# EasyEDA Pro project 工程教育PCB设计图.epro

# Schematic Schematic1
Board Name: Board1; Create Date: 2025-10-13; Page Name: P1; Project Name: EP2C8_EVM; Schematic Name: Schematic1; Update Date: 2025-11-10; Company: 嘉立创EDA; Page Size: A4; Version: V1.0
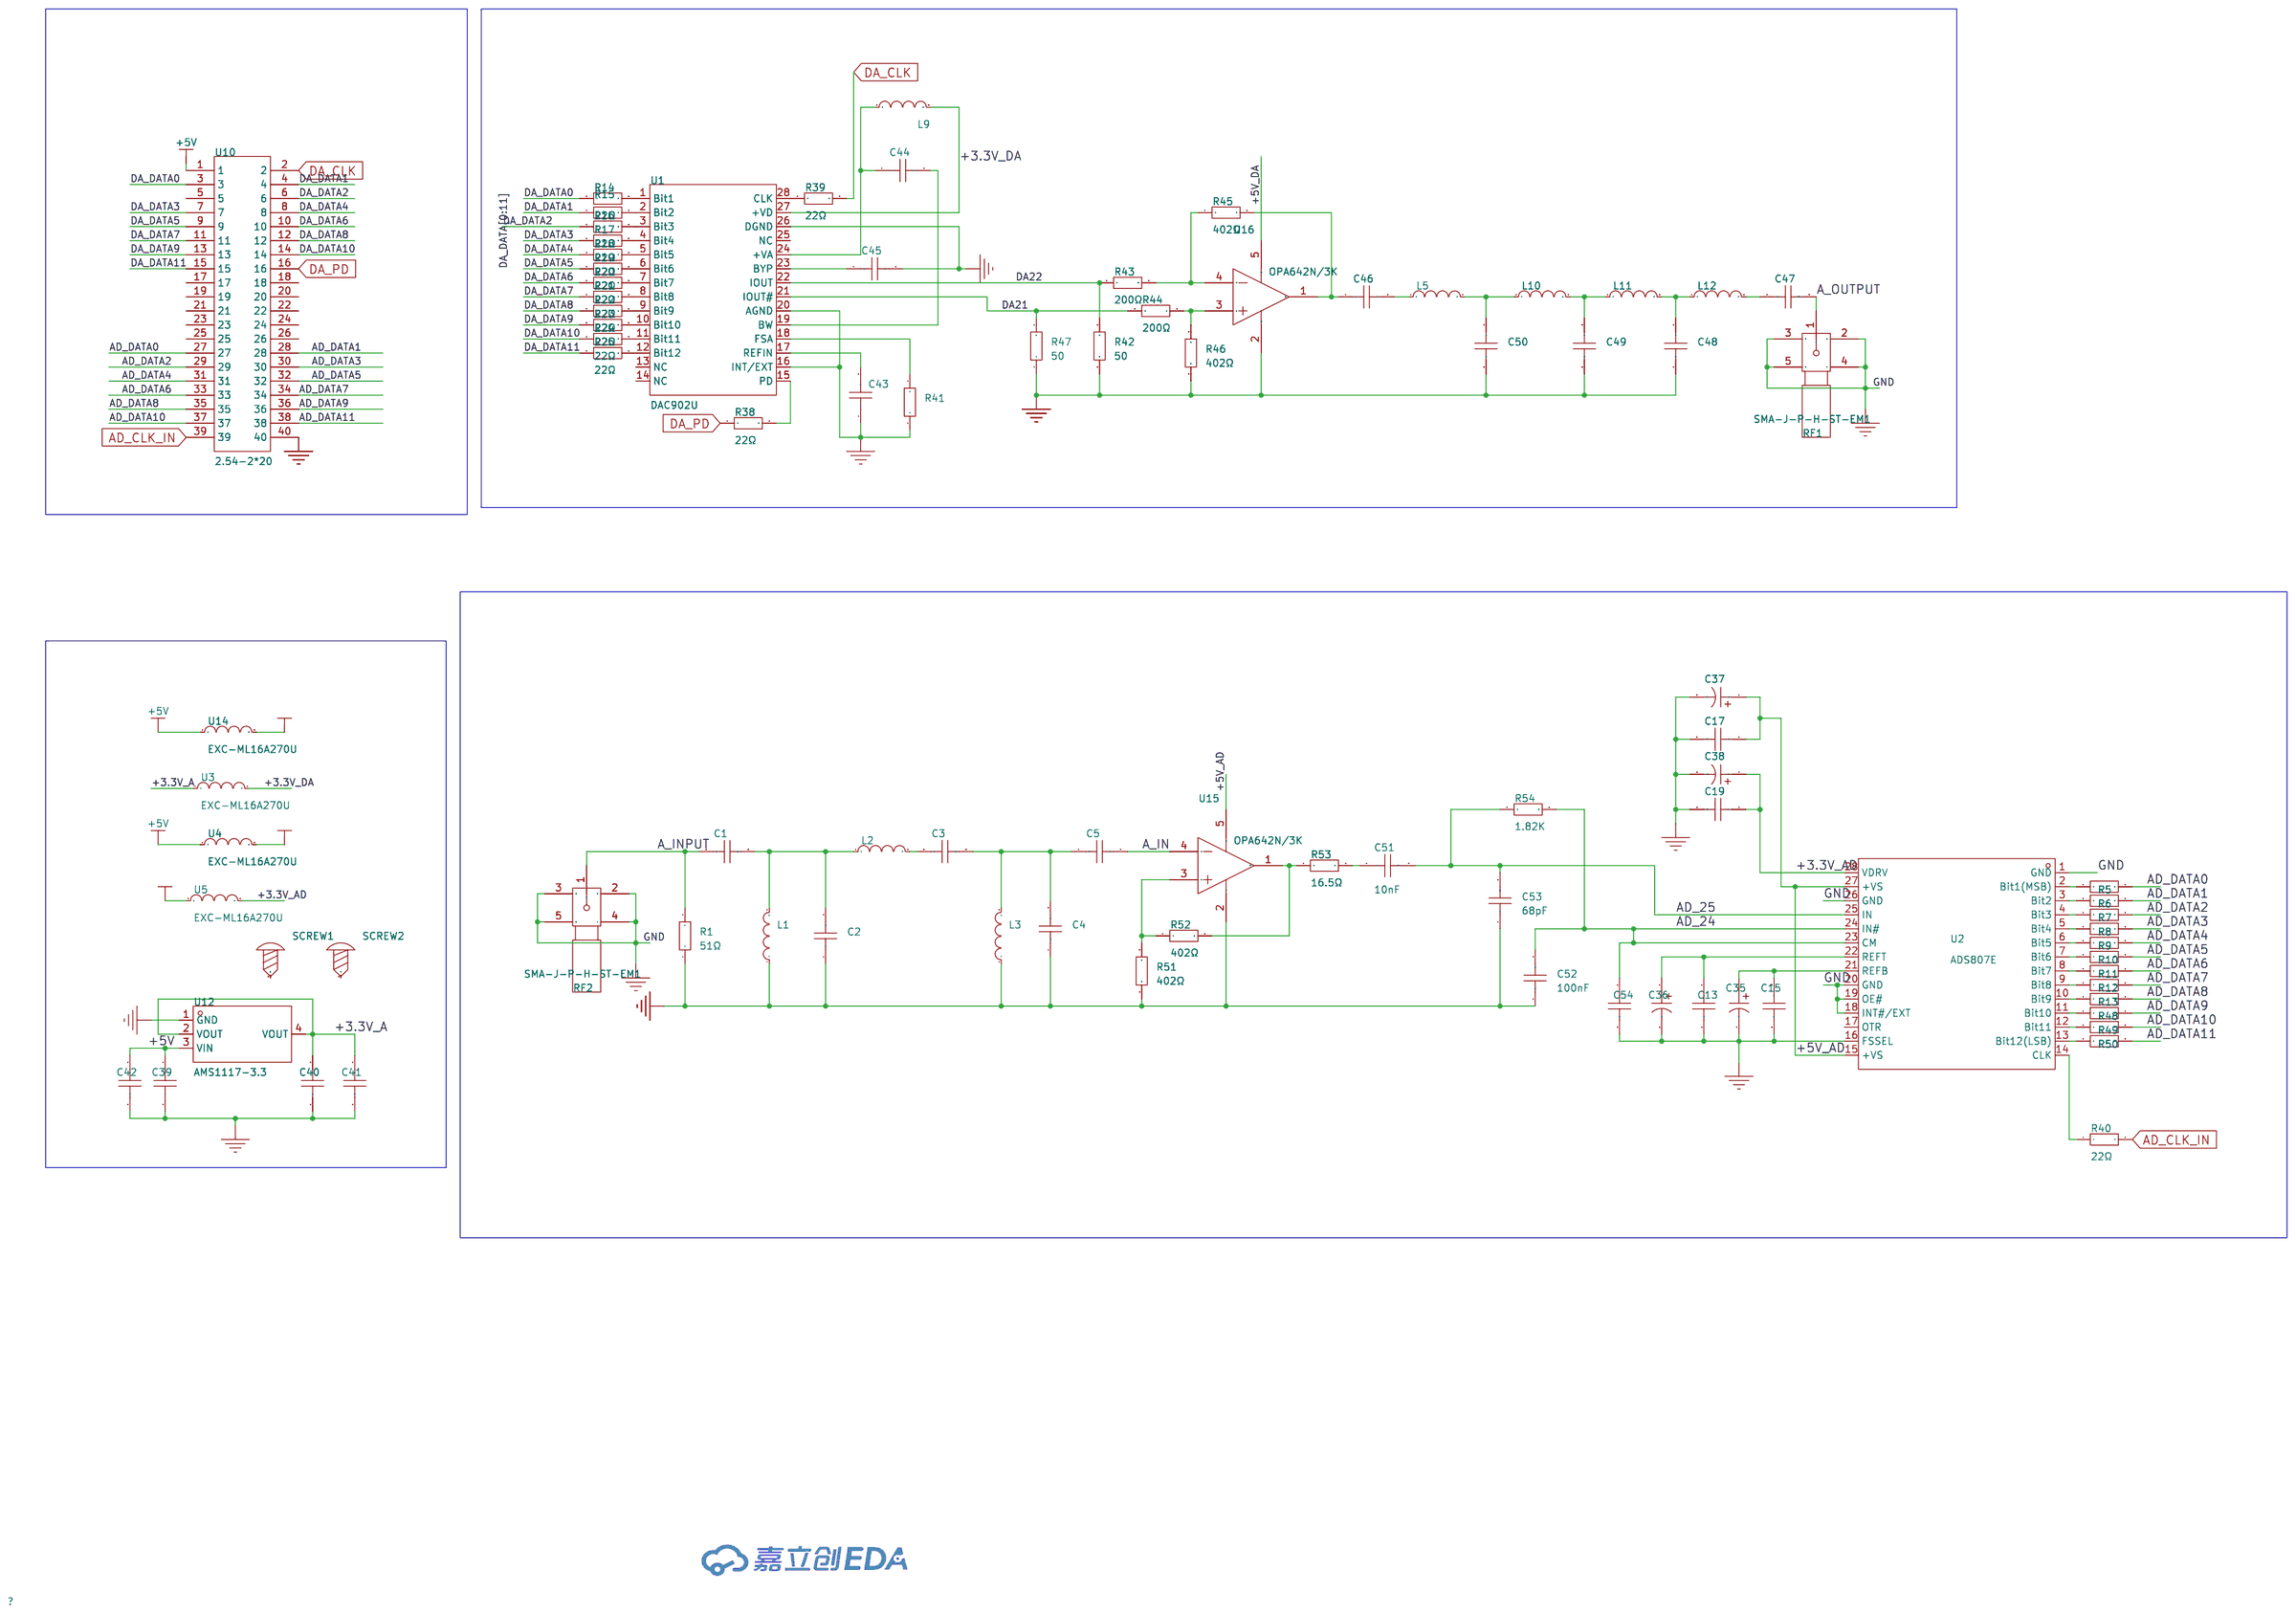
[diagram p0: schematic sheet]

## Parts
C1  100nF  [C0805]
C2  100nF  [C0805]
C3  100nF  [C0805]
C4  100nF  [C0805]
C5  100nF  [C0805]
C13  100nF  [C0805]
C15  100nF  [C0805]
C17  100nF  [C0805]
C19  100nF  [C0805]
C35  10uF  [C0805]
C36  10uF  [C0805]
C37  10uF  [C0805]
C38  10uF  [C0805]
C39  100nF  [C0805]
C40  100nF  [C0805]
C41  22uF  [C0805]
C42  22uF  [C0805]
C43  100nF  [C0805]
C44  100nF  [C0805]
C45  100nF  [C0805]
C46  100nF  [C0805]
C47  100nF  [C0805]
C48  500pF  [C0805]
C49  850pF  [C0805]
C50  500pF  [C0805]
C51  10nF  [C0805]
C52  100nF  [C0805]
C53  68pF  [C0805]
C54  100nF  [C0805]
L1  1uH  [L0805]
L2  1uH  [L0805]
L3  1uH  [L0805]
L5  500nH  [L0805]
L9  1uH  [L0805]
L10  2uH  [L0805]
L11  2uH  [L0805]
L12  500nH  [L0805]
R1  51Ω  [R0805]
R5  22Ω  [R0805]
R6  22Ω  [R0805]
R7  22Ω  [R0805]
R8  22Ω  [R0805]
R9  22Ω  [R0805]
R10  22Ω  [R0805]
R11  22Ω  [R0805]
R12  22Ω  [R0805]
R13  22Ω  [R0805]
R14  22Ω  [R0805]
R15  22Ω  [R0805]
R16  22Ω  [R0805]
R17  22Ω  [R0805]
R18  22Ω  [R0805]
R19  22Ω  [R0805]
R20  22Ω  [R0805]
R21  22Ω  [R0805]
R22  22Ω  [R0805]
R23  22Ω  [R0805]
R24  22Ω  [R0805]
R25  22Ω  [R0805]
R38  22Ω  [R0805]
R39  22Ω  [R0805]
R40  22Ω  [R0805]
R41  2kΩ  [R0805]
R42  50  [R0805]
R43  200Ω  [R0805]
R44  200Ω  [R0805]
R45  402Ω  [R0805]
R46  402Ω  [R0805]
R47  50  [R0805]
R48  22Ω  [R0805]
R49  22Ω  [R0805]
R50  22Ω  [R0805]
R51  402Ω  [R0805]
R52  402Ω  [R0805]
R53  16.5Ω  [R0805]
R54  1.82K  [R0603]
RF1  SMA-J-P-H-ST-EM1  [SMA-SMD_SMA-J-P-H-ST-EM1]
RF2  SMA-J-P-H-ST-EM1  [SMA-SMD_SMA-J-P-H-ST-EM1]
SCREW1  -  [M3螺丝]
SCREW2  -  [M3螺丝]
U1  DAC902U  [SOIC-28_L18.0-W7.5-P1.27-LS10.3-BL]
U2  ADS807E  [SSOP-28_L10.2-W5.3-P0.65-LS7.8-BL]
U3  EXC-ML16A270U  [L0805]
U4  EXC-ML16A270U  [L0805]
U5  EXC-ML16A270U  [L0805]
U10  2.54-2*20  [HDR-TH_40P-P2.54-V-F-R2-C20-S2.54]
U12  AMS1117-3.3  [SOT-223-3_L6.5-W3.4-P2.30-LS7.0-BR]
U14  EXC-ML16A270U  [L0805]
U15  OPA642N/3K  [SOT-23-5_L2.9-W1.6-P0.95-LS2.8-BR]
U16  OPA642N/3K  [SOT-23-5_L2.9-W1.6-P0.95-LS2.8-BR]

## Library data of the parts
C1-C5 C13 C15 C17 C19 C43-C47 C51 C52 C54 = CC0805KRX7R9BB104: 容值:100nF;精度:±10%;额定电压:50V;温度系数:X7R;; LCSC Part Name: 100nF ±10% 50V; Supplier Part: C49678; Manufacturer: YAGEO(国巨); Supplier Footprint: 0805; JLCPCB Part Class: Basic Part; Datasheet: https://item.szlcsc.com/datasheet/CC0805KRX7R9BB104/50686.html; Supplier: LCSC; Tolerance: ±10%; Voltage Rating: 50V; Temperature Coefficient: X7R
C35-C38 = CL21A106KAYNNNE_C15850: 容值:10uF;精度:±10%;额定电压:25V;温度系数:X5R;; LCSC Part Name: 10uF ±10% 25V; Supplier Part: C15850; Manufacturer: SAMSUNG(三星); Manufacturer Part: CL21A106KAYNNNE; Supplier Footprint: 0805; JLCPCB Part Class: Basic Part; Datasheet: https://item.szlcsc.com/datasheet/CL21A106KAYNNNE/16532.html; Supplier: LCSC; Tolerance: ±10%; Voltage Rating: 25V; Temperature Coefficient: X5R
C39 C40 = 0805B104K500NT: 容值:100nF;精度:±10%;额定电压:50V;温度系数:X7R;; LCSC Part Name: 100nF ±10% 50V; Supplier Part: C38141; Manufacturer: FH(风华); Supplier Footprint: 0805; JLCPCB Part Class: Extended Part; Datasheet: https://item.szlcsc.com/datasheet/0805B104K500NT/39123.html; Supplier: LCSC; Tolerance: ±10%; Voltage Rating: 50V; Temperature Coefficient: X7R
C41 C42 = CL21A226MAQNNNE: 容值:22uF;精度:±20%;额定电压:25V;温度系数:X5R;; LCSC Part Name: 22uF ±20% 25V; Supplier Part: C45783; Manufacturer: SAMSUNG(三星); Supplier Footprint: 0805; JLCPCB Part Class: Basic Part; Datasheet: https://item.szlcsc.com/datasheet/CL21A226MAQNNNE/46786.html; Supplier: LCSC; Tolerance: ±20%; Voltage Rating: 25V; Temperature Coefficient: X5R
C48 C50 = 0805CG501J500NT: 容值:500pF;精度:±5%;额定电压:50V;温度系数:C0G;; LCSC Part Name: 500pF ±5% 50V; Supplier Part: C502148; Manufacturer: FH(风华); Supplier Footprint: 0805; JLCPCB Part Class: Extended Part; Datasheet: https://item.szlcsc.com/datasheet/0805CG501J500NT/514622.html; Supplier: LCSC; Tolerance: ±5%; Voltage Rating: 50V; Temperature Coefficient: C0G
C49 = C06BL851X-5ZN-X0T: 容值:850pF;额定电压:50V;材质(温度系数):-;; LCSC Part Name: 850pF 50V; Supplier Part: C2182486; Manufacturer: Knowles(楼氏); Supplier Footprint: 0603; JLCPCB Part Class: Extended Part; Datasheet: https://atta.szlcsc.com/upload/public/pdf/source/20210701/A8D84A7CCA583A64334CADCD8883E930.pdf; Supplier: LCSC; Voltage Rated: 50V
C53 = 0805CG680J500NT: 容值:68pF;精度:±5%;额定电压:50V;温度系数:C0G;; LCSC Part Name: 68pF ±5% 50V; Supplier Part: C1834; Manufacturer: FH(风华); Supplier Footprint: 0805; JLCPCB Part Class: Extended Part; Datasheet: https://item.szlcsc.com/datasheet/0805CG680J500NT/2186.html; Supplier: LCSC; Tolerance: ±5%; Voltage Rating: 50V; Temperature Coefficient: C0G
L1-L3 L9 = SDFL2012Q1R0KTF: 电感值:1uH;精度:±10%;额定电流:50mA;饱和电流(Isat):-;直流电阻(DCR):400mΩ;; LCSC Part Name: 1uH ±10%; Supplier Part: C1042; Manufacturer: Sunlord(顺络); Supplier Footprint: 0805; JLCPCB Part Class: Extended Part; Datasheet: https://atta.szlcsc.com/upload/public/pdf/source/20231027/097A17DDB71564CE812E62F0F80142C9.pdf; Supplier: LCSC; Tolerance: ±10%; Rated Current: 50mA; DC Resistance(DCR): 400mΩ
L5 L12 = CKP1608DR50M-T: 电感值:500nH;精度:±20%;额定电流:900mA;饱和电流(Isat):-;直流电阻(DCR):150mΩ;; LCSC Part Name: 500nH ±20%; Supplier Part: C1332706; Manufacturer: TAIYO YUDEN(太诱); Supplier Footprint: 0603; JLCPCB Part Class: Extended Part; Supplier: LCSC; Tolerance: ±20%; Rated Current: 900mA; DC Resistance (DCR): 150mΩ
L10 L11 = LQW21FT2R0M0HL: 电感值:2uH;精度:±20%;额定电流:400mA;饱和电流(Isat):450mA;类型:-;; LCSC Part Name: 2uH ±20% 450mA; Supplier Part: C3224251; Manufacturer: muRata(村田); Supplier Footprint: 0805; JLCPCB Part Class: Extended Part; Datasheet: https://atta.szlcsc.com/upload/public/pdf/source/20230811/7FF6CDD65734065C8B751B954647AC9F.pdf; Supplier: LCSC; Tolerance: ±20%; Rated Current: 400mA; Saturation Current (Isat): 450mA; DC Resistance (DCR): 290mΩ; Ratings: AEC-Q200
R1 = 0805W8F510JT5E: 电阻类型:厚膜电阻;阻值:51Ω;精度:±1%;功率:125mW;工作电压:150V;温度系数:±100ppm/℃;; LCSC Part Name: 51Ω ±1% 125mW 厚膜电阻; Supplier Part: C17738; Manufacturer: UNI-ROYAL(厚声); Supplier Footprint: 0805; JLCPCB Part Class: Basic Part; Datasheet: https://item.szlcsc.com/datasheet/0805W8F510JT5E/18426.html; Supplier: LCSC; Type: 厚膜电阻; Tolerance: ±1%; Power(Watts): 125mW; Voltage-Supply(Max): 150V; Temperature Coefficient: ±100ppm/℃; Operating Temperature: -55℃~+155℃
R5-R25 R38-R40 R48-R50 = 0805W8F220JT5E: 电阻类型:厚膜电阻;阻值:22Ω;精度:±1%;功率:125mW;工作电压:150V;温度系数:±100ppm/℃;; LCSC Part Name: 22Ω ±1% 125mW 厚膜电阻; Supplier Part: C17561; Manufacturer: UNI-ROYAL(厚声); Supplier Footprint: 0805; JLCPCB Part Class: Basic Part; Datasheet: https://item.szlcsc.com/datasheet/0805W8F220JT5E/18249.html; Supplier: LCSC; Type: 厚膜电阻; Tolerance: ±1%; Power(Watts): 125mW; Voltage-Supply(Max): 150V; Temperature Coefficient: ±100ppm/℃; Operating Temperature: -55℃~+155℃
R41 = 0805W8F2001T5E: 电阻类型:厚膜电阻;阻值:2kΩ;精度:±1%;功率:125mW;最大工作电压:150V;温度系数:±100ppm/℃;; LCSC Part Name: 2kΩ ±1% 125mW 厚膜电阻; Supplier Part: C17604; Manufacturer: UNI-ROYAL(厚声); Supplier Footprint: 0805; JLCPCB Part Class: Basic Part; Datasheet: https://atta.szlcsc.com/upload/public/pdf/source/20200306/C422600_1E6D84923E4A46A82E41ADD87F860B5C.pdf; Supplier: LCSC; Type: 厚膜电阻; Tolerance: ±1%; Power(Watts): 125mW; Overload Voltage (Max): 150V; Temperature Coefficient: ±100ppm/℃; Operating Temperature Range: -55℃~+155℃
R42 = ERJ6ENF28R7V: 电阻类型:厚膜电阻;阻值:28.7Ω;精度:±1%;功率:125mW;工作电压:-;温度系数:±100ppm/℃;; LCSC Part Name: 28.7Ω ±1% 125mW 厚膜电阻; Supplier Part: C410001; Manufacturer: PANASONIC(松下); Supplier Footprint: 0805; JLCPCB Part Class: Extended Part; Datasheet: https://atta.szlcsc.com/upload/public/pdf/source/20190806/C410001_32B30BDA5F8CC3E45BF6058462DD66F8.pdf; Supplier: LCSC; Type: 厚膜电阻; Tolerance: ±1%; Power(Watts): 125mW; Temperature Coefficient: ±100ppm/℃; Operating Temperature: -55℃~+155℃
R43 R44 = 0805W8F2000T5E: 电阻类型:厚膜电阻;阻值:200Ω;精度:±1%;功率:125mW;工作电压:150V;温度系数:±100ppm/℃;; LCSC Part Name: 200Ω ±1% 125mW 厚膜电阻; Supplier Part: C17540; Manufacturer: UNI-ROYAL(厚声); Supplier Footprint: 0805; JLCPCB Part Class: Basic Part; Datasheet: https://item.szlcsc.com/datasheet/0805W8F2000T5E/18228.html; Supplier: LCSC; Type: 厚膜电阻; Tolerance: ±1%; Power(Watts): 125mW; Voltage-Supply(Max): 150V; Temperature Coefficient: ±100ppm/℃; Operating Temperature: -55℃~+155℃
R45 R46 R51 R52 = FRC0805F4020TS: 电阻类型:厚膜电阻;阻值:402Ω;精度:±1%;功率:125mW;工作电压:150V;温度系数:±100ppm/℃;; LCSC Part Name: 402Ω ±1% 125mW 厚膜电阻; Supplier Part: C3000538; Manufacturer: FOJAN(富捷); Supplier Footprint: 0805; JLCPCB Part Class: Extended Part; Supplier: LCSC; Type: 厚膜电阻; Tolerance: ±1%; Power(Watts): 125mW; Voltage-Supply(Max): 150V; Temperature Coefficient: ±100ppm/℃; Operating Temperature: -55℃~+155℃
R47 = ERJ6ENF26R1V: 电阻类型:厚膜电阻;阻值:26.1Ω;精度:±1%;功率:125mW;工作电压:-;温度系数:±100ppm/℃;; LCSC Part Name: 26.1Ω ±1% 125mW 厚膜电阻; Supplier Part: C409998; Manufacturer: PANASONIC(松下); Supplier Footprint: 0805; JLCPCB Part Class: Extended Part; Datasheet: https://atta.szlcsc.com/upload/public/pdf/source/20190806/C409998_D0484842FF8F2855523445FE858F3126.pdf; Supplier: LCSC; Type: 厚膜电阻; Tolerance: ±1%; Power(Watts): 125mW; Temperature Coefficient: ±100ppm/℃; Operating Temperature: -55℃~+155℃
R53 = RC0805FR-0716R5L: 电阻类型:厚膜电阻;阻值:16.5Ω;精度:±1%;功率:125mW;温度系数:±100ppm/℃;; LCSC Part Name: 厚膜电阻 16.5Ω ±1% 125mW; Supplier Part: C483017; Manufacturer: YAGEO(国巨); Supplier Footprint: 0805; JLCPCB Part Class: Extended Part; Datasheet: https://atta.szlcsc.com/upload/public/pdf/source/20200715/C483017_12DE2DB4E558DFE58DE2959C275B6B80.pdf; Supplier: LCSC; Type: 厚膜电阻; Tolerance: ±1%; Power(Watts): 125mW; Temperature Coefficient: ±100ppm/℃; Operating Temperature Range: -55℃~+155℃
R54 = Res_0603: Supplier Footprint: 0603
RF1 RF2 = SMA-J-P-H-ST-EM1: LCSC Part Name: SMA; Supplier Part: C5199907; Manufacturer: SAMTEC; JLCPCB Part Class: 扩展库; Datasheet: https://atta.szlcsc.com/upload/public/pdf/source/20230606/647C7C046193D6DFEB6EC0711495C006.pdf; Supplier: LCSC; Connector Type: 板端; Number of Ports: 1; Frequency-Max: 20GHz; RF Series: SMA; Impedance: 50Ω
SCREW1 SCREW2 = M3螺丝: Supplier Footprint: 插件
U1 = DAC902U: 分辨率:12位;接口类型:-;工作电压:2.7V~5.5V;稳定时间:30ns;积分非线性:1LSB;; LCSC Part Name: 12位, 165MSPS 数模转换器; Supplier Part: C1555011; Manufacturer: TI(德州仪器); Supplier Footprint: SOIC-28-300mil; Datasheet: https://www.ti.com/cn/lit/gpn/dac902; Supplier: LCSC; Resolution(Bits): 12位; Number of Channels: 1; Voltage - Supply: 2.7V~5.5V; Settling Time: 30ns; Integral non - linearity: 1LSB; Operating Temperature: -40℃~+85℃
U2 = ADS807E: Supplier Part: C1542930; Manufacturer: TI(德州仪器); Supplier Footprint: SSOP-28-208mil; JLCPCB Part Class: 扩展库; Datasheet: https://www.ti.com/cn/lit/gpn/ads807; Supplier: LCSC; Resolution(Bits): 12位; Sampling Rate: 53MHz; Voltage - Supply: 4.75V~5.25V; differential input: 是; Operating Temperature: -40℃~+85℃
U3-U5 U14 = EXC-ML16A270U: Supplier Part: C19618930; Manufacturer: PANASONIC(松下); JLCPCB Part Class: Extended Part; Datasheet: https://atta.szlcsc.com/upload/public/pdf/source/20231225/8503B10F165686323F08E5A5D6826CE3.pdf; Supplier: LCSC
U10 = 2.54-2*20: 插孔结构:2x20P;间距:2.54mm;行距:2.54mm;圆孔/方孔:方孔;安装方式:直插;排数:双排;总孔位数:40P;额定电流:2.5A;额定电压:-;插孔方向:顶部;塑高:8.5mm;工作温度:-40℃~+105℃;; LCSC Part Name: 间距:2.54mm 2x20P 直插; Supplier Part: C2977589; Manufacturer: ZHOURI(洲日); Supplier Footprint: 插件,P=2.54mm; JLCPCB Part Class: 扩展库; Datasheet: https://item.szlcsc.com/datasheet/2.54-2*20/3388941.html; Supplier: LCSC; Holes Structure: 2x20P; Pitch: 2.54mm; Row Spacing: 2.54mm; Circular Hole / Square Hole: 方孔; Mounting Type: 直插; Number of Rows: 双排; Number of Positions: 40P; Current Rating: 2.5A; Holes Direction: 顶部; Insulation Height: 8.5mm; Operating Temperature: -40℃~+105℃
U12 = AMS1117-3.3: LCSC Part Name: 输出3.3V 1A; Supplier Part: C6186; Manufacturer: AMS; Supplier Footprint: SOT-223; JLCPCB Part Class: 基础库; Datasheet: https://atta.szlcsc.com/upload/public/pdf/source/20180727/C6186_7A095716F0823C02F1997A905E26C086.pdf; Supplier: LCSC; Output Type: 固定; Output Voltage: 3.3V; Output Current: 1A; Power Supply Rejection Ratio (PSRR): 72dB@(120Hz); Voltage Dropout: 1.3V@(800mA); Features: 过流保护(OCP)；热关断(TSD); Output Configuration: 正极; Number of Outputs: 1; Design Item ID: AMS1117-3.3_C6186
U15 U16 = OPA642N/3K: 放大器数:单路;增益带宽积(GBP):210MHz;输入偏置电流(Ib):25uA;压摆率(SR):380V/us;带宽(-3db):-;; Supplier Part: C4368080; Manufacturer: TI(德州仪器); Supplier Footprint: SOT-23-5; JLCPCB Part Class: 扩展库; Datasheet: https://atta.szlcsc.com/upload/public/pdf/source/20230921/9A2D181AF1194B17DAF1CC40183595B2.pdf; Supplier: LCSC; Number of Circuits: 单路; Gain Bandwidth Product(GBP): 210MHz; Current - Input Bias(Ib): 25uA; Slew Rate(SR): 380V/us; Output Current: 60mA; Operating Temperature: -40℃~+85℃

## Nets
+3.3V_A: C40.1 C41.1 U3.1 U5.1 U12.2(VOUT) U12.4(VOUT)
+3.3V_AD: C19.1 C38.1 U2.28(VDRV) U5.2
+3.3V_DA: L9.2 U1.27(+VD) U3.2
+5V: C39.1 C42.1 U4.1 U10.1 U12.3(VIN) U14.1
+5V_AD: C17.1 C37.1 U2.15(+VS) U2.27(+VS) U4.2 U15.5(VS+)
+5V_DA: U14.2 U16.5(VS+)
GND: C2.1 C4.1 C13.2 C15.2 C17.2 C19.2 C35.2 C36.2 C37.2 C38.2 C39.2 C40.2 C41.2 C42.2 C43.1 C45.2 C48.1 C49.1 C50.1 C52.1 C53.1 C54.2 L1.1 L3.1 R1.1 R41.1 R42.1 R46.1 R47.1 R51.1 RF1.2 RF1.3 RF1.4 RF1.5 RF2.2 RF2.3 RF2.4 RF2.5 U1.16(INT/EXT) U1.20(AGND) U1.26(DGND) U2.1(GND) U2.16(FSSEL) U2.18(INT#/EXT) U2.19(OE#) U2.20(GND) U2.26(GND) U10.40 U12.1(GND) U15.2(VS-) U16.2(VS-)
A_IN: C5.2 U15.4(-IN)
A_INPUT: C1.1 R1.2 RF2.1
A_OUTPUT: C47.2 RF1.1
AD_24: C52.2 C54.1 R54.2 U2.23(CM) U2.24(IN#)
AD_25: C51.2 C53.2 R54.1 U2.25(IN)
AD_CLK_IN: R40.2 U10.39
AD_DATA0: R5.2 U10.27
AD_DATA1: R6.2 U10.28
AD_DATA2: R7.2 U10.29
AD_DATA3: R8.2 U10.30
AD_DATA4: R9.2 U10.31
AD_DATA5: R10.2 U10.32
AD_DATA6: R11.2 U10.33
AD_DATA7: R12.2 U10.34
AD_DATA8: R13.2 U10.35
AD_DATA9: R48.2 U10.36
AD_DATA10: R49.2 U10.37
AD_DATA11: R50.2 U10.38
DA21: R44.1 R47.2 U1.21(IOUT#)
DA22: R42.2 R43.1 U1.22(IOUT)
DA_CLK: R39.2 U10.2
DA_DATA0: R14.1 U10.3
DA_DATA1: R15.1 U10.4
DA_DATA2: R16.1 U10.6
DA_DATA3: R17.1 U10.7
DA_DATA4: R18.1 U10.8
DA_DATA5: R19.1 U10.9
DA_DATA6: R20.1 U10.10
DA_DATA7: R21.1 U10.11
DA_DATA8: R22.1 U10.12
DA_DATA9: R23.1 U10.13
DA_DATA10: R24.1 U10.14
DA_DATA11: R25.1 U10.15
DA_PD: R38.1 U10.16
$1N1041: R38.2 U1.15(PD)
$1N6900: R14.2 U1.1(Bit1)
$1N6902: R15.2 U1.2(Bit2)
$1N6904: R16.2 U1.3(Bit3)
$1N6906: R17.2 U1.4(Bit4)
$1N6908: R18.2 U1.5(Bit5)
$1N6910: R19.2 U1.6(Bit6)
$1N6912: R20.2 U1.7(Bit7)
$1N6914: R21.2 U1.8(Bit8)
$1N6916: R22.2 U1.9(Bit9)
$1N6918: R23.2 U1.10(Bit10)
$1N6920: R24.2 U1.11(Bit11)
$1N6922: R25.2 U1.12(Bit12)
$1N18747: R39.1 U1.28(CLK)
$1N20951: C44.1 L9.1 U1.24(+VA)
$1N20954: C45.1 U1.23(BYP)
$1N20956: C44.2 U1.19(BW)
$1N20960: C43.2 U1.17(REFIN)
$1N20963: R41.2 U1.18(FSA)
$1N21392: C47.1 L12.2
$1N21393: C46.2 L5.1
$1N21399: C48.2 L11.2 L12.1
$1N21400: C50.2 L5.2 L10.1
$1N21401: C49.2 L10.2 L11.1
$1N21404: R43.2 R45.1 U16.4(-IN)
$1N21407: C46.1 R45.2 U16.1(OUT)
$1N21408: R44.2 R46.2 U16.3(+IN)
$1N23466: R50.1 U2.13(Bit12(LSB))
$1N23467: R49.1 U2.12(Bit11)
$1N23468: R48.1 U2.11(Bit10)
$1N23469: R13.1 U2.10(Bit9)
$1N23470: R12.1 U2.9(Bit8)
$1N23471: R11.1 U2.8(Bit7)
$1N23472: R10.1 U2.7(Bit6)
$1N23473: R9.1 U2.6(Bit5)
$1N23474: R8.1 U2.5(Bit4)
$1N23475: R7.1 U2.4(Bit3)
$1N23476: R6.1 U2.3(Bit2)
$1N23477: R5.1 U2.2(Bit1(MSB))
$1N23502: C13.1 C36.1 U2.22(REFT)
$1N23511: R40.1 U2.14(CLK)
$1N23512: C15.1 C35.1 U2.21(REFB)
$1N23963: C1.2 C2.2 L1.2 L2.1
$1N23964: C3.1 L2.2
$1N23965: C3.2 C4.2 C5.1 L3.2
$1N23972: C51.1 R53.2
$1N23973: R51.2 R52.1 U15.3(+IN)
$1N23975: R52.2 R53.1 U15.1(OUT)

Not connected (* = marked no-connect by the designer): SCREW1 1; SCREW2 1; U1 13(NC) 14(NC) 25(NC); U2 17(OTR); U10 5 17 18 19 20 21 22 23 24 25 26

# Board PCB1
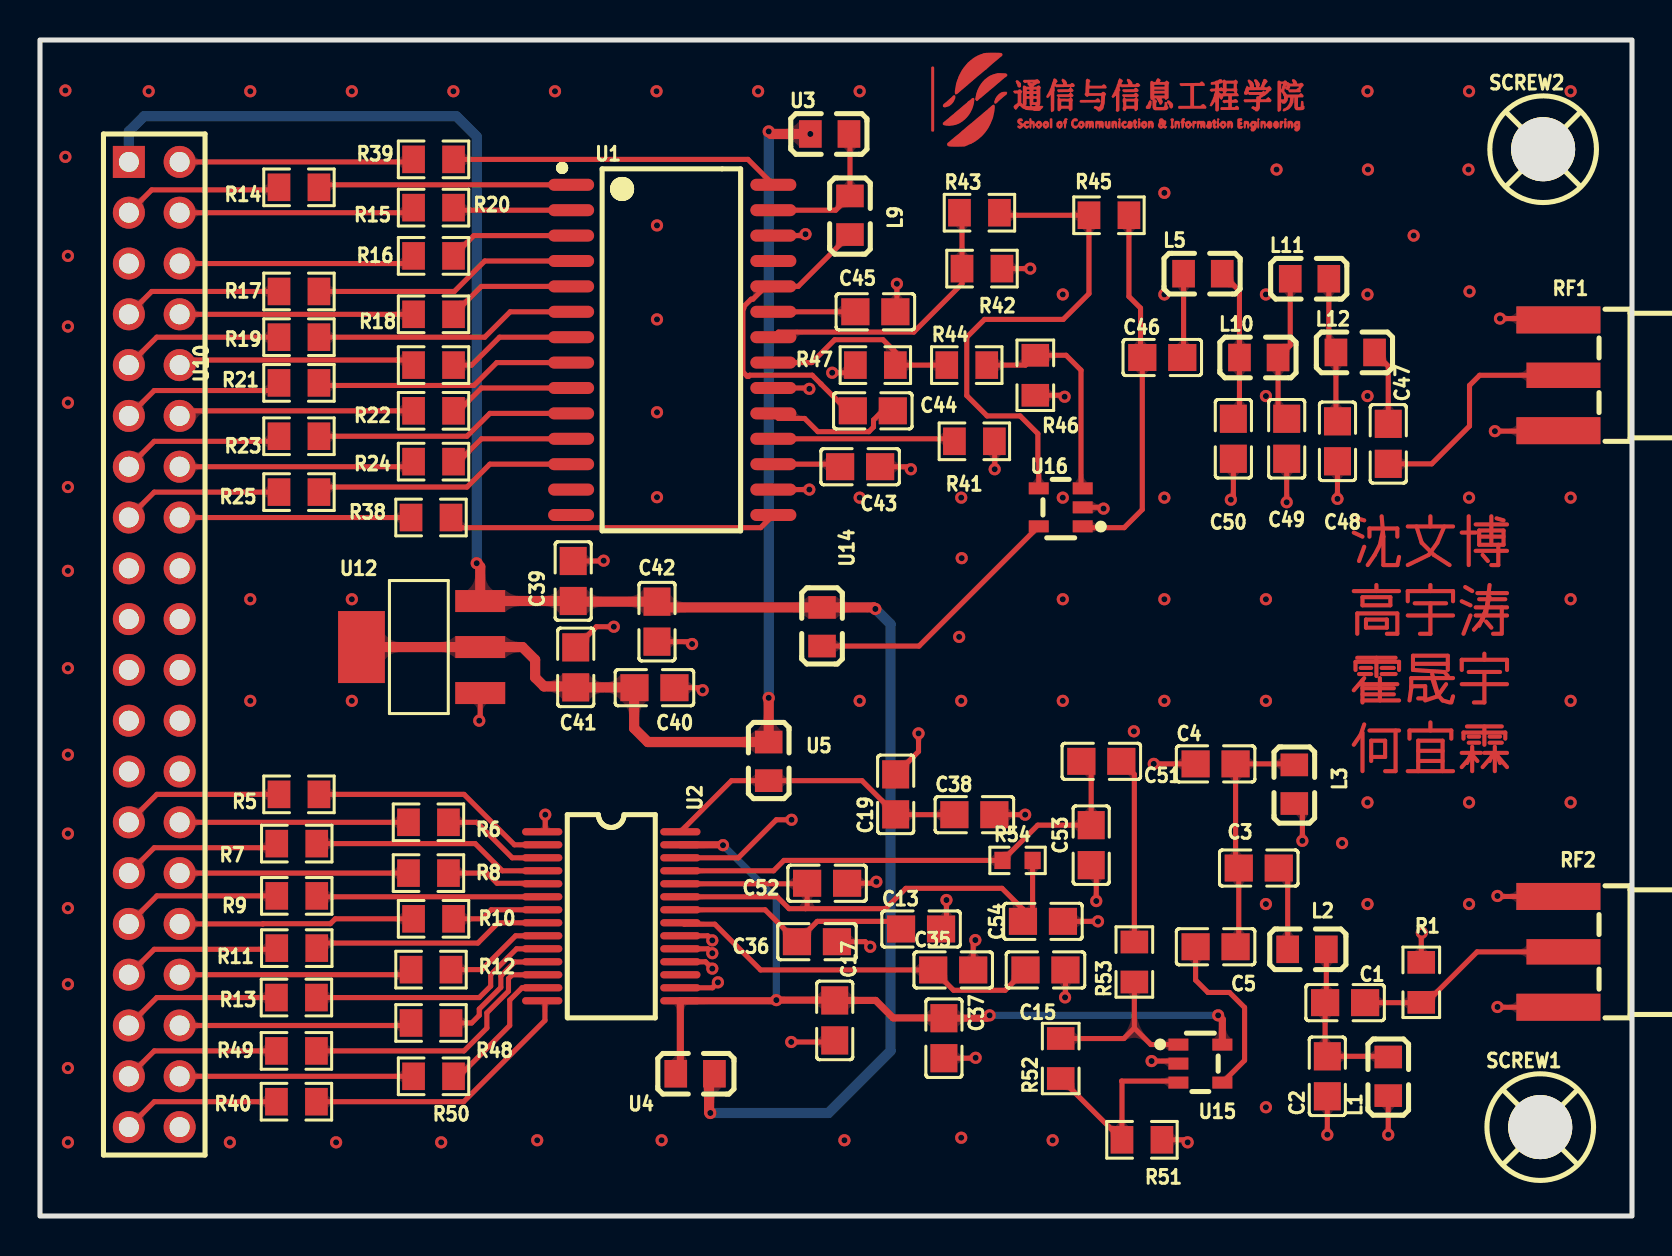
[diagram p1: board, top side]
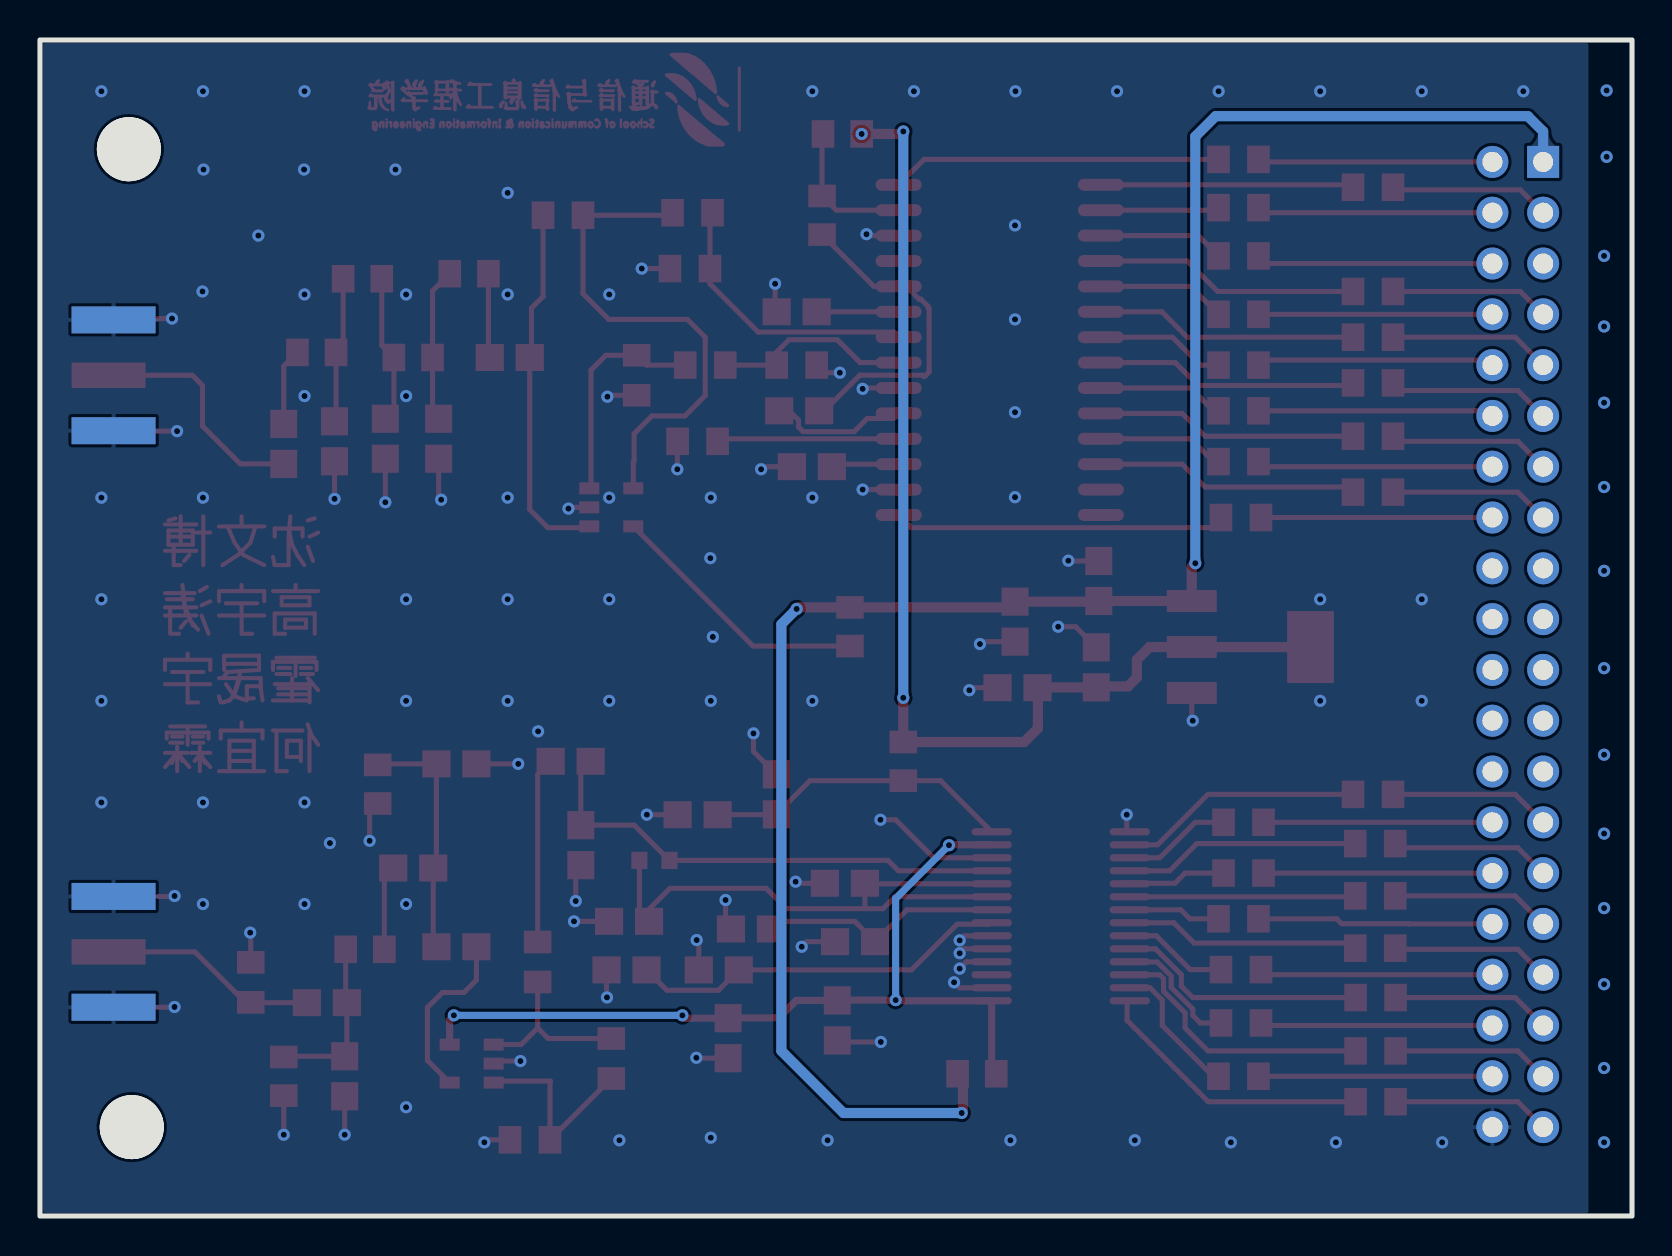
[diagram p2: board, bottom side, seen from below]

Outline 79.63 x 58.8 mm; copper layers: Top Layer, Bottom Layer. Coordinates in mm from the lower left corner of the outline.
Outline path: rectangle 0,58.8 79.63,0
Stack: Top Layer 0.035mm / Dielectric1 1.51mm FR4 er 4.5 / Bottom Layer 0.035mm

## Design rules (mm)
template: 自定义配置
spacing copperThickness1oz: track to track 0.102, other pairs 0.152 to 0.3
spacing copperThickness2oz (default): track to track 0.102, other pairs 0.152 to 0.3
track width copperThickness1oz (default): min 0.127, default 0.254, max 2.54
track width copperThickness2oz: min 0.203, default 0.254, max 2.54
differential pair differentialPair (default): width min 0.127, default 0.254, max 2.54; gap min 0.152, default 0.152
via viaSize (default): diameter min 0.5, default 0.61, max 10; hole min 0.3, default 0.305, max 6.3

## Placement (name value [footprint] x y rotation side)
C1  100nF  [C0805]  65.28 10.67 180 top
C2  100nF  [C0805]  64.39 6.98 90 top
C3  100nF  [C0805]  60.96 17.4 180 top
C4  100nF  [C0805]  58.8 22.61 0 top
C5  100nF  [C0805]  58.8 13.46 180 top
C13  100nF  [C0805]  44.07 14.35 0 top
C15  100nF  [C0805]  50.29 12.3 0 top
C17  100nF  [C0805]  39.75 9.78 270 top
C19  100nF  [C0805]  42.8 21.08 90 top
C35  10uF  [C0805]  45.68 12.3 0 top
C36  10uF  [C0805]  38.86 13.72 0 top
C37  10uF  [C0805]  45.21 8.89 270 top
C38  10uF  [C0805]  46.74 20.07 0 top
C39  100nF  [C0805]  26.67 31.75 90 top
C40  100nF  [C0805]  30.73 26.42 0 top
C41  22uF  [C0805]  26.8 27.43 90 top
C42  22uF  [C0805]  30.86 29.72 270 top
C43  100nF  [C0805]  41.02 37.46 180 top
C44  100nF  [C0805]  41.66 40.26 0 top
C45  100nF  [C0805]  41.78 45.21 0 top
C46  100nF  [C0805]  56.13 42.93 0 top
C47  100nF  [C0805]  67.44 38.61 270 top
C48  500pF  [C0805]  64.9 38.73 90 top
C49  850pF  [C0805]  62.36 38.86 90 top
C50  500pF  [C0805]  59.69 38.86 90 top
C51  10nF  [C0805]  53.09 22.73 180 top
C52  100nF  [C0805]  39.37 16.64 180 top
C53  68pF  [C0805]  52.58 18.54 90 top
C54  100nF  [C0805]  50.16 14.73 0 top
L1  1uH  [L0805]  67.44 6.98 90 top
L2  1uH  [L0805]  63.37 13.33 180 top
L3  1uH  [L0805]  62.74 21.59 90 top
L5  500nH  [L0805]  58.17 47.12 0 top
L9  1uH  [L0805]  40.51 50.04 90 top
L10  2uH  [L0805]  60.96 42.93 0 top
L11  2uH  [L0805]  63.5 46.86 0 top
L12  500nH  [L0805]  65.79 43.18 0 top
R1  51Ω  [R0805]  69.09 11.68 270 top
R5  22Ω  [R0805]  12.95 21.08 180 top
R6  22Ω  [R0805]  19.43 19.68 180 top
R7  22Ω  [R0805]  12.84 18.62 180 top
R8  22Ω  [R0805]  19.43 17.14 180 top
R9  22Ω  [R0805]  12.84 16.01 180 top
R10  22Ω  [R0805]  19.69 14.86 180 top
R11  22Ω  [R0805]  12.84 13.39 180 top
R12  22Ω  [R0805]  19.56 12.32 180 top
R13  22Ω  [R0805]  12.83 10.92 180 top
R14  22Ω  [R0805]  12.95 51.43 0 top
R15  22Ω  [R0805]  19.69 50.42 0 top
R16  22Ω  [R0805]  19.69 48.01 0 top
R17  22Ω  [R0805]  12.95 46.23 0 top
R18  22Ω  [R0805]  19.69 45.08 0 top
R19  22Ω  [R0805]  12.95 43.94 0 top
R20  22Ω  [R0805]  19.69 42.54 0 top
R21  22Ω  [R0805]  12.95 41.66 0 top
R22  22Ω  [R0805]  19.69 40.26 0 top
R23  22Ω  [R0805]  12.95 38.99 0 top
R24  22Ω  [R0805]  19.69 37.72 0 top
R25  22Ω  [R0805]  12.95 36.19 0 top
R38  22Ω  [R0805]  19.56 34.92 0 top
R39  22Ω  [R0805]  19.69 52.83 180 top
R40  22Ω  [R0805]  12.83 5.72 180 top
R41  2kΩ  [R0805]  46.74 38.73 180 top
R42  50  [R0805]  47.12 47.37 180 top
R43  200Ω  [R0805]  46.99 50.16 0 top
R44  200Ω  [R0805]  46.35 42.54 0 top
R45  402Ω  [R0805]  53.47 50.04 0 top
R46  402Ω  [R0805]  49.78 42.04 90 top
R47  50  [R0805]  41.78 42.54 0 top
R48  22Ω  [R0805]  19.56 9.65 180 top
R49  22Ω  [R0805]  12.83 8.25 180 top
R50  22Ω  [R0805]  19.69 6.98 180 top
R51  402Ω  [R0805]  55.12 3.81 180 top
R52  402Ω  [R0805]  51.05 7.87 90 top
R53  16.5Ω  [R0805]  54.74 12.7 90 top
R54  1.82K  [R0603]  48.89 17.78 0 top
RF1  SMA-J-P-H-ST-EM1  [SMA-SMD_SMA-J-P-H-ST-EM1]  76.07 42.04 270 top
RF2  SMA-J-P-H-ST-EM1  [SMA-SMD_SMA-J-P-H-ST-EM1]  76.07 13.21 270 top
SCREW1  -  [M3螺丝]  75.04 4.44 0 top
SCREW2  -  [M3螺丝]  75.18 53.34 0 top
U1  DAC902U  [SOIC-28_L18.0-W7.5-P1.27-LS10.3-BL]  31.62 43.31 270 top
U2  ADS807E  [SSOP-28_L10.2-W5.3-P0.65-LS7.8-BL]  28.57 14.99 270 top
U3  EXC-ML16A270U  [L0805]  39.5 54.1 0 top
U4  EXC-ML16A270U  [L0805]  32.77 7.11 180 top
U5  EXC-ML16A270U  [L0805]  36.45 22.73 270 top
U10  2.54-2*20  [HDR-TH_40P-P2.54-V-F-R2-C20-S2.54]  5.71 28.57 270 top
U12  AMS1117-3.3  [SOT-223-3_L6.5-W3.4-P2.30-LS7.0-BR]  19.05 28.45 0 top
U14  EXC-ML16A270U  [L0805]  39.12 29.46 270 top
U15  OPA642N/3K  [SOT-23-5_L2.9-W1.6-P0.95-LS2.8-BR]  58.04 7.62 180 top
U16  OPA642N/3K  [SOT-23-5_L2.9-W1.6-P0.95-LS2.8-BR]  51.05 35.43 0 top

## Footprints (pads in the part's own frame, mm; a bottom-side part is the same pattern mirrored in y, then rotated)
C0805
  rect 1.41x1.35 smd: 1(-1,0) 2(1,0)
HDR-TH_40P-P2.54-V-F-R2-C20-S2.54
  rect 1.6x1.6 hole 1: 1(-24.13,-1.27)
  round 1.6 hole 1: 2(-24.13,1.27) 3(-21.59,-1.27) 4(-21.59,1.27) 5(-19.05,-1.27) 6(-19.05,1.27) 7(-16.51,-1.27) 8(-16.51,1.27) 9(-13.97,-1.27) 10(-13.97,1.27) 11(-11.43,-1.27) 12(-11.43,1.27) 13(-8.89,-1.27) 14(-8.89,1.27) 15(-6.35,-1.27) 16(-6.35,1.27) 17(-3.81,-1.27) 18(-3.81,1.27) 19(-1.27,-1.27) 20(-1.27,1.27) 21(1.27,-1.27) 22(1.27,1.27) 23(3.81,-1.27) 24(3.81,1.27) 25(6.35,-1.27) 26(6.35,1.27) 27(8.89,-1.27) 28(8.89,1.27) 29(11.43,-1.27) 30(11.43,1.27) 31(13.97,-1.27) 32(13.97,1.27) 33(16.51,-1.27) 34(16.51,1.27) 35(19.05,-1.27) 36(19.05,1.27) 37(21.59,-1.27) 38(21.59,1.27) 39(24.13,-1.27) 40(24.13,1.27)
L0805
  rect 1.133x1.377 smd: 1(-0.966,0) 2(0.966,0)
M3螺丝
  round 3.2 hole 3.2: 1(0,0)
R0603
  rect 0.806x0.864 smd: 1(-0.753,0) 2(0.753,0)
R0805
  rect 1.133x1.377 smd: 1(-1,0) 2(1,0)
SMA-SMD_SMA-J-P-H-ST-EM1
  rect 1.27x3.7 smd: 1(0,0.125)
  rect 1.35x4.2 smd: 2(-2.77,-0.125) 3(2.77,-0.125)
  rect 1.35x4.2 smd far side: 4(-2.77,-0.125) 5(2.77,-0.125)
SOIC-28_L18.0-W7.5-P1.27-LS10.3-BL
  oval 0.6x2.3 smd: 1(-8.255,-5.058) 2(-6.985,-5.058) 3(-5.715,-5.058) 4(-4.445,-5.058) 5(-3.175,-5.058) 6(-1.905,-5.058) 7(-0.635,-5.058) 8(0.635,-5.058) 9(1.905,-5.058) 10(3.175,-5.058) 11(4.445,-5.058) 12(5.715,-5.058) 13(6.985,-5.058) 14(8.255,-5.058) 15(8.255,5.058) 16(6.985,5.058) 17(5.715,5.058) 18(4.445,5.058) 19(3.175,5.058) 20(1.905,5.058) 21(0.635,5.058) 22(-0.635,5.058) 23(-1.905,5.058) 24(-3.175,5.058) 25(-4.445,5.058) 26(-5.715,5.058) 27(-6.985,5.058) 28(-8.255,5.058)
SOT-23-5_L2.9-W1.6-P0.95-LS2.8-BR
  rect 1x0.6 smd: 1(1.1,-0.95) 2(1.1,0) 3(1.1,0.95) 4(-1.1,0.95) 5(-1.1,-0.95)
SOT-223-3_L6.5-W3.4-P2.30-LS7.0-BR
  rect 2.5x1.1 smd: 1(2.97,-2.3) 2(2.97,0) 3(2.97,2.3)
  rect 2.34x3.6 smd: 4(-2.97,0)
SSOP-28_L10.2-W5.3-P0.65-LS7.8-BL
  oval 0.364x2.015 smd: 1(-4.225,-3.455) 2(-3.575,-3.455) 3(-2.925,-3.455) 4(-2.275,-3.455) 5(-1.625,-3.455) 6(-0.975,-3.455) 7(-0.325,-3.455) 8(0.325,-3.455) 9(0.975,-3.455) 10(1.625,-3.455) 11(2.275,-3.455) 12(2.925,-3.455) 13(3.575,-3.455) 14(4.225,-3.455) 15(4.225,3.455) 16(3.575,3.455) 17(2.925,3.455) 18(2.275,3.455) 19(1.625,3.455) 20(0.975,3.455) 21(0.325,3.455) 22(-0.325,3.455) 23(-0.975,3.455) 24(-1.625,3.455) 25(-2.275,3.455) 26(-2.925,3.455) 27(-3.575,3.455) 28(-4.225,3.455)

## Nets
As in the schematic.

Pads without a net: SCREW1 1; SCREW2 1; U1 13 14 25; U2 17; U10 5 17 18 19 20 21 22 23 24 25 26

## Via types
v1: diameter 0.61, hole 0.305, Top Layer to Bottom Layer, 136 vias

## Routing (per net, layer and track width the routed paths; a pad name or vN(x,y) marks a point on that pad's centre or on a via; arc(x,y) is an arc through that point)
+3.3V_A: length 56.7
  Top Layer w0.508: v1(36.45,25.91) U5.1 30.4,23.7 29.72,24.38 29.72,26.4 C40.1 29.72,26.43 C41.1 26.75,26.48 25.21,26.48 24.76,26.92 24.76,27.81 24.13,28.45 U12.2 U12.4 ; v1(36.45,54.23) 36.58,54.1 v1(38.53,54.1)
  Bottom Layer w0.508: v1(36.45,54.23) v1(36.45,25.91)
+3.3V_AD: length 15.5
  Top Layer w0.254: U2.28 34.59,21.77 U5.2 41.11,21.77 C19.1 42.81,20.07 C38.1
+3.3V_DA: length 7.2
  Top Layer w0.254: U3.2 40.51,54.05 L9.2 39.8,50.29 U1.27
+5V: length 97.6
  Top Layer w0.508: v1(33.53,5.15) 33.47,5.21 33.47,7.11 ; v1(41.78,30.35) 41.71,30.43 U14.1 31.15,30.43 C42.1 26.7,30.72 C39.1 22.02,30.75 U12.3 22.02,32.46 v1(21.84,32.64)
  Bottom Layer w0.508: v1(33.53,5.15) 39.44,5.15 42.54,8.25 42.54,29.59 v1(41.78,30.35) ; v1(21.84,32.64) 21.84,53.97 20.83,54.99 5.21,54.99 4.44,54.23 4.44,52.7
+5V_AD: length 43.6
  Top Layer w0.355: 32.07,7.11 32.03,7.15 U2.15 36.8,10.76 v1(36.83,10.79) 39.73,10.79 C17.1 41.8,10.78 42.67,9.91 45.2,9.91 C37.1 47.35,9.89 v1(47.5,10.03) ; v1(58.93,10.03) 59.14,9.82 U15.5 ; U2.27 34.14,18.56 v1(34.16,18.54)
  Bottom Layer w0.355: v1(34.16,18.54) 36.83,15.88 v1(36.83,10.79) ; v1(47.5,10.03) v1(58.93,10.03)
+5V_DA: length 13.3
  Top Layer w0.254: U16.5 43.97,28.5 U14.2
GND: length 87.2
  Top Layer w0.254: v1(41.83,16.71) 41.76,16.64 C52.1 ; v1(25.27,20.07) 25.27,19.24 25.25,19.21 ; v1(72.9,16) 72.92,15.98 RF2.2 ; RF1.3 75.92,39.24 v1(72.77,39.24) ; C2.1 v1(64.39,4.06) ; U1.16 v1(38.48,36.32) ; U2.26 34.92,17.91 34.92,17.91 36.83,19.81 v1(37.59,19.81) ; C17.2 39.67,8.7 v1(37.57,8.7) ; RF2.3 72.91,10.44 v1(72.9,10.45) ; R41.1 47.75,38.72 v1(47.75,37.34) ; C45.2 42.86,45.29 v1(42.86,46.61) ; v1(53.2,35.37) 53.13,35.43 U16.2 ; U1.20 38.44,41.4 v1(38.48,41.36) ; C38.2 v1(49.28,20.07) ; v1(69.12,14.17) 69.09,14.14 R1.1 ; C37.2 46.78,7.89 v1(46.8,7.91) ; v1(33.63,12.37) 33.29,12.71 32.16,12.71 ; v1(57.4,3.68) 57.28,3.81 R51.1 ; C15.2 51.29,10.95 v1(51.27,10.93) ; C53.1 52.83,17.29 v1(52.83,15.75) ; v1(33.63,13.14) 33.41,13.36 32.16,13.36 ; v1(59.56,35.81) 59.69,35.94 C50.1 ; v1(33.91,11.68) 33.64,11.41 32.16,11.41 ; C36.2 41.28,13.72 v1(41.53,13.46) ; v1(73.03,44.87) 75.88,44.87 RF1.2 ; C42.2 32.5,28.72 v1(32.62,28.6) ; C40.2 33.02,26.42 v1(33.15,26.29) ; C48.1 v1(64.9,35.86) ; C49.1 v1(62.36,35.69) ; v1(28.19,32.77) 28.18,32.75 C39.2 ; R46.1 51.18,41.04 v1(51.25,40.96) ; C13.2 45.34,14.62 v1(45.34,15.8) ; C4.1 v1(55.71,22.61) ; C54.2 v1(52.92,14.73) ; v1(33.63,13.78) 33.4,14.01 32.16,14.01 ; C43.1 43.43,37.46 v1(43.56,37.34) ; U15.2 56.81,7.75 v1(55.6,7.75) ; C41.2 27.83,29.46 v1(28.7,29.46) ; R47.1 40.4,42.16 v1(39.62,42.16) ; v1(21.97,24.76) 22.02,24.81 U12.1 ; C19.2 43.94,23.22 v1(43.94,24.13) ; L3.1 63.14,20.22 v1(63.14,18.76) ; R42.1 v1(49.53,47.37) ; U1.26 38.22,49.02 v1(38.29,49.09) ; L1.1 v1(67.44,4.06) ; v1(46.78,13.8) 46.68,13.69 C35.2
  vias: v1(1.27,56.28) v1(1.27,52.96) v1(1.4,48.01) v1(1.4,44.48) v1(1.4,40.67) v1(1.4,36.45) v1(1.4,32.26) v1(1.4,27.39) v1(1.4,23.06) v1(1.4,19.12) v1(1.4,15.4) v1(1.4,11.59) v1(1.4,7.4) v1(1.4,3.68) v1(5.44,56.24) v1(9.5,3.68) v1(10.52,56.24) v1(10.52,30.84) v1(10.52,25.76) v1(14.81,3.68) v1(15.6,56.24) v1(15.6,30.84) v1(15.6,25.76) v1(20.07,3.68) v1(20.68,56.24) v1(24.87,3.79) v1(25.76,56.24) v1(30.84,56.24) v1(30.86,49.53) v1(30.86,44.83) v1(30.86,40.19) v1(30.86,35.94) v1(31.09,3.79) v1(35.92,56.24) v1(40.24,3.79) v1(41,56.24) v1(41,35.92) v1(41,25.76) v1(45.97,28.96) v1(46.08,35.92) v1(46.08,25.76) v1(46.08,3.91) v1(46.1,32.89) v1(50.65,3.79) v1(51.16,46.08) v1(51.16,35.92) v1(51.16,30.84) v1(51.16,25.76) v1(54.71,24.23) v1(56.24,51.16) v1(56.24,46.08) v1(56.24,35.92) v1(56.24,30.84) v1(56.24,25.76) v1(61.32,46.08) v1(61.32,41) v1(61.32,30.84) v1(61.32,25.76) v1(61.32,15.6) v1(61.32,5.44) v1(61.85,52.32) v1(65.13,18.65) v1(66.4,56.24) v1(66.42,52.32) v1(66.4,46.08) v1(66.4,41) v1(66.4,20.68) v1(66.4,15.6) v1(68.71,49.02) v1(71.48,56.24) v1(71.45,52.32) v1(71.48,35.92) v1(71.48,20.68) v1(71.48,15.6) v1(71.5,46.23) v1(76.56,56.24) v1(76.56,35.92) v1(76.56,30.84) v1(76.56,25.76) v1(76.56,20.68)
A_IN: length 8.9
  Top Layer w0.254: C5.2 57.8,11.79 58.42,11.18 59.5,11.18 60.25,10.42 60.25,7.78 U15.4
A_INPUT: length 11
  Top Layer w0.254: C1.1 69.07,10.67 R1.2 69.36,10.68 71.88,13.21 RF2.1
A_OUTPUT: length 11.8
  Top Layer w0.254: RF1.1 72.01,42.04 71.5,41.53 71.5,39.5 69.61,37.61 C47.2
AD_24: length 29.5
  Top Layer w0.254: 38.29,15.37 42.29,15.37 43.31,16.38 48.12,16.38 49.16,15.34 49.16,14.74 C54.1 49.65,15.22 R54.2 ; 38.29,15.37 38.37,15.45 C52.2 38.34,16.61 32.16,16.61 ; 38.29,15.37 37.47,15.37 36.87,15.96 32.16,15.96
AD_25: length 24.6
  Top Layer w0.254: 47.89,17.78 37.21,17.78 36.69,17.26 U2.25 ; C51.2 52.58,22.24 C53.2 49.9,19.54 R54.1
AD_CLK_IN: length 7.9
  Top Layer w0.254: U10.39 5.71,5.72 R40.2
AD_DATA0: length 8.1
  Top Layer w0.254: R5.2 5.84,21.08 U10.27
AD_DATA1: length 11.4
  Top Layer w0.254: U10.28 R6.2
AD_DATA2: length 8
  Top Layer w0.254: R7.2 11.64,18.41 5.71,18.41 4.44,17.14
AD_DATA3: length 11.4
  Top Layer w0.254: 6.98,17.14 R8.2
AD_DATA4: length 8
  Top Layer w0.254: R9.2 5.85,16.01 U10.31
AD_DATA5: length 11.8
  Top Layer w0.254: U10.32 11.15,14.6 11.16,14.61 14.52,14.61 14.77,14.86 R10.2
AD_DATA6: length 8.1
  Top Layer w0.254: 4.44,12.06 5.71,13.33 11.53,13.33 11.84,13.65
AD_DATA7: length 11.7
  Top Layer w0.254: R12.2 18.3,12.06 6.98,12.06
AD_DATA8: length 8
  Top Layer w0.254: 4.44,9.53 5.84,10.92 R13.2
AD_DATA9: length 11.6
  Top Layer w0.254: 6.98,9.53 18.43,9.53 R48.2
AD_DATA10: length 7.9
  Top Layer w0.254: U10.37 5.71,8.25 R49.2
AD_DATA11: length 11.7
  Top Layer w0.254: U10.38 R50.2
DA21: length 10.1
  Top Layer w0.254: U1.21 38.61,42.67 39.75,43.81 42.16,43.81 42.78,43.2 R47.2 R44.1
DA22: length 14.1
  Top Layer w0.254: U1.22 36.93,44.2 43.7,44.2 46.12,46.61 R42.2 46.12,50.04 R43.1
DA_CLK: length 11.8
  Top Layer w0.254: R39.2 18.56,52.7 6.98,52.7
DA_DATA0: length 8
  Top Layer w0.254: R14.1 11.83,51.31 5.59,51.31 U10.3
DA_DATA1: length 11.8
  Top Layer w0.254: U10.4 18.43,50.16 R15.1
DA_DATA2: length 11.9
  Top Layer w0.254: R16.1 18.3,47.62 6.98,47.62
DA_DATA3: length 8
  Top Layer w0.254: R17.1 5.59,46.23 U10.7
DA_DATA4: length 11.7
  Top Layer w0.254: U10.8 R18.1
DA_DATA5: length 8.1
  Top Layer w0.254: U10.9 5.84,43.94 R19.1
DA_DATA6: length 11.9
  Top Layer w0.254: R20.1 18.43,42.8 7.24,42.8 U10.10
DA_DATA7: length 8.2
  Top Layer w0.254: R21.1 11.57,41.27 5.71,41.27 U10.11
DA_DATA8: length 11.9
  Top Layer w0.254: U10.12 7.24,40.26 18.43,40.26 18.69,40
DA_DATA9: length 8.2
  Top Layer w0.254: 11.95,39.24 11.45,38.73 5.71,38.73 U10.13
DA_DATA10: length 11.7
  Top Layer w0.254: U10.14 18.69,37.46
DA_DATA11: length 8.1
  Top Layer w0.254: 11.95,36.45 11.7,36.19 5.71,36.19 4.44,34.92
DA_PD: length 11.6
  Top Layer w0.254: 6.98,34.92 R38.1
$1N1041: length 16.6
  Top Layer w0.254: U1.15 36.05,34.42 21.07,34.42 R38.2
$1N6900: length 12.7
  Top Layer w0.254: R14.2 14.08,51.56 U1.1
$1N6902: length 5.9
  Top Layer w0.254: U1.2 20.81,50.29 R15.2
$1N6904: length 6.3
  Top Layer w0.254: R16.2 21.7,49.02 U1.3
$1N6906: length 13.2
  Top Layer w0.254: U1.4 22.25,47.75 20.72,46.23 R17.2
$1N6908: length 6.5
  Top Layer w0.254: U1.5 22.08,46.48 R18.2
$1N6910: length 13.1
  Top Layer w0.254: U1.6 23.52,45.21 22.25,43.94 R19.2
$1N6912: length 6.5
  Top Layer w0.254: U1.7 22.99,43.94 21.59,42.54 R20.2
$1N6914: length 13.1
  Top Layer w0.254: R21.2 14.08,41.53 21.7,41.53 22.85,42.67 U1.8
$1N6916: length 6.5
  Top Layer w0.254: U1.9 22.08,41.4 20.69,40
$1N6918: length 13.2
  Top Layer w0.254: 13.95,39.24 14.21,38.99 21.36,38.99 22.5,40.13 U1.10
$1N6920: length 6.5
  Top Layer w0.254: 20.69,37.46 22.08,38.86 U1.11
$1N6922: length 13.1
  Top Layer w0.254: 13.95,36.45 21.36,36.45 22.5,37.59 U1.12
$1N18747: length 16.5
  Top Layer w0.254: R39.1 35.41,52.83 U1.28
$1N20951: length 16.5
  Top Layer w0.254: 40.66,40.13 40.53,40.13 39.06,41.6 39.06,41.6 38.62,42.04 35.5,42.04 35.45,41.99 35.37,41.99 35.16,42.2 35.16,45.34 35.2,45.38 35.2,45.47 35.57,45.84 35.66,45.84 36.17,46.35 36.55,46.35 U1.24 37.92,46.48 L9.1
$1N20954: length 4.1
  Top Layer w0.254: U1.23 C45.1
$1N20956: length 7
  Top Layer w0.254: C44.2 42.15,40.26 41.69,39.8 41.69,39.45 41.46,39.22 38.91,39.22 38.25,39.88 36.93,39.88 U1.19
$1N20960: length 3.4
  Top Layer w0.254: C43.2 39.89,37.59 U1.17
$1N20963: length 9.1
  Top Layer w0.254: U1.18 45.61,38.86 R41.2
$1N21392: length 3.9
  Top Layer w0.254: C47.1 67.44,42.49 66.75,43.18
$1N21393: length 4.2
  Top Layer w0.254: C46.2 57.2,42.99 L5.1
$1N21399: length 7.3
  Top Layer w0.254: L11.2 64.47,43.53 L12.1 64.82,39.81 C48.2
$1N21400: length 7.7
  Top Layer w0.254: L5.2 59.99,46.26 59.99,40.17 C50.2
$1N21401: length 7.4
  Top Layer w0.254: L11.1 62.53,43.53 L10.2 61.93,40.29 C49.2
$1N21404: length 25.5
  Top Layer w0.254: U16.4 49.95,37.73 49.91,37.77 49.91,39.12 49.02,40 47.37,40 46.35,41.02 46.35,43.94 47.24,44.83 51.18,44.83 52.47,46.12 R45.1 48.12,50.04 R43.2
$1N21407: length 18.4
  Top Layer w0.254: R45.2 54.47,45.97 55.05,45.39 55.05,43.01 C46.1 55.13,35.32 54.23,34.42 52.22,34.42 U16.1
$1N21408: length 11.2
  Top Layer w0.254: R44.2 49.29,42.54 R46.2 51.32,43.04 52.07,42.29 52.07,36.47 U16.3
$1N23466: length 7
  Top Layer w0.254: U2.13 24.11,11.41 23.5,10.79 23.5,9.53 20.95,6.98 R50.1
$1N23467: length 13.7
  Top Layer w0.254: R49.1 21.21,8.25 22.35,9.4 22.35,10.16 23.43,11.24 23.43,11.87 23.62,12.06 U2.12
$1N23468: length 6.3
  Top Layer w0.254: R48.1 21.59,9.65 21.97,10.03 21.97,10.35 23.05,11.43 23.05,12 23.75,12.7 25.11,12.7 U2.11
$1N23469: length 12.8
  Top Layer w0.254: 25.25,13.36 23.84,13.36 22.54,12.06 22.54,11.49 21.97,10.92 R13.1
$1N23470: length 5.4
  Top Layer w0.254: 25.25,14.01 23.79,14.01 22.1,12.32 R12.1
$1N23471: length 11.8
  Top Layer w0.254: 13.84,13.65 21.9,13.65 22.92,14.66 25.25,14.66
$1N23472: length 4.7
  Top Layer w0.254: 25.25,15.31 22.57,15.31 22.12,14.86 R10.1
$1N23473: length 11.4
  Top Layer w0.254: 25.25,15.96 13.89,15.96 R9.1
$1N23474: length 5
  Top Layer w0.254: R8.1 22.35,17.14 22.86,16.64 25.22,16.64 25.25,16.61
$1N23475: length 12
  Top Layer w0.254: R7.1 21.77,18.62 23.12,17.26 25.25,17.26
$1N23476: length 5.6
  Top Layer w0.254: 25.25,17.91 23.62,17.91 21.84,19.68 R6.1
$1N23477: length 12.3
  Top Layer w0.254: 25.25,18.56 23.73,18.56 21.21,21.08 R5.1
$1N23502: length 12.2
  Top Layer w0.254: C13.1 42.69,14.73 38.88,14.73 C36.1 36.27,15.31 32.16,15.31
$1N23511: length 14.1
  Top Layer w0.254: 25.25,10.76 25.26,10.75 25.26,9.78 21.19,5.72 R40.1
$1N23512: length 19
  Top Layer w0.254: 32.16,14.66 32.23,14.59 33.75,14.59 36.04,12.3 C35.1 45.69,11.29 48.28,11.29 C15.1
$1N23963: length 8.5
  Top Layer w0.254: L2.1 64.34,10.73 C1.2 64.28,8.1 C2.2 67.4,7.98 L1.2
$1N23964: length 4.2
  Top Layer w0.254: C3.1 62.41,16.95 L2.2
$1N23965: length 12.2
  Top Layer w0.254: L3.2 62.69,22.61 C4.2 59.8,17.56 C3.2 59.96,13.62 C5.1
$1N23972: length 9.3
  Top Layer w0.254: C51.1 54.74,22.08 R53.2
$1N23973: length 10.1
  Top Layer w0.254: R52.1 R51.2 54.12,6.73 54.1,6.75 56.86,6.75 U15.3
$1N23975: length 8.7
  Top Layer w0.254: 54.74,9.4 55.56,8.57 56.94,8.57 U15.1 ; 54.74,9.4 R53.1 ; 54.74,9.4 54.21,8.87 R52.2

## Copper pours and planes (outline as drawn; the poured copper is in the pictures)
GND on Bottom Layer: 2.29,62.1 90.68,62.1 90.68,-4.44 2.29,-4.44

Small or netless copper shapes (teardrops, artwork), in the pictures only: 404 on Top Layer, 10 on Bottom Layer

## Text on the board
Top Layer: 沈文博 / 高宇涛 / 霍晟宇 / 何宜霖
